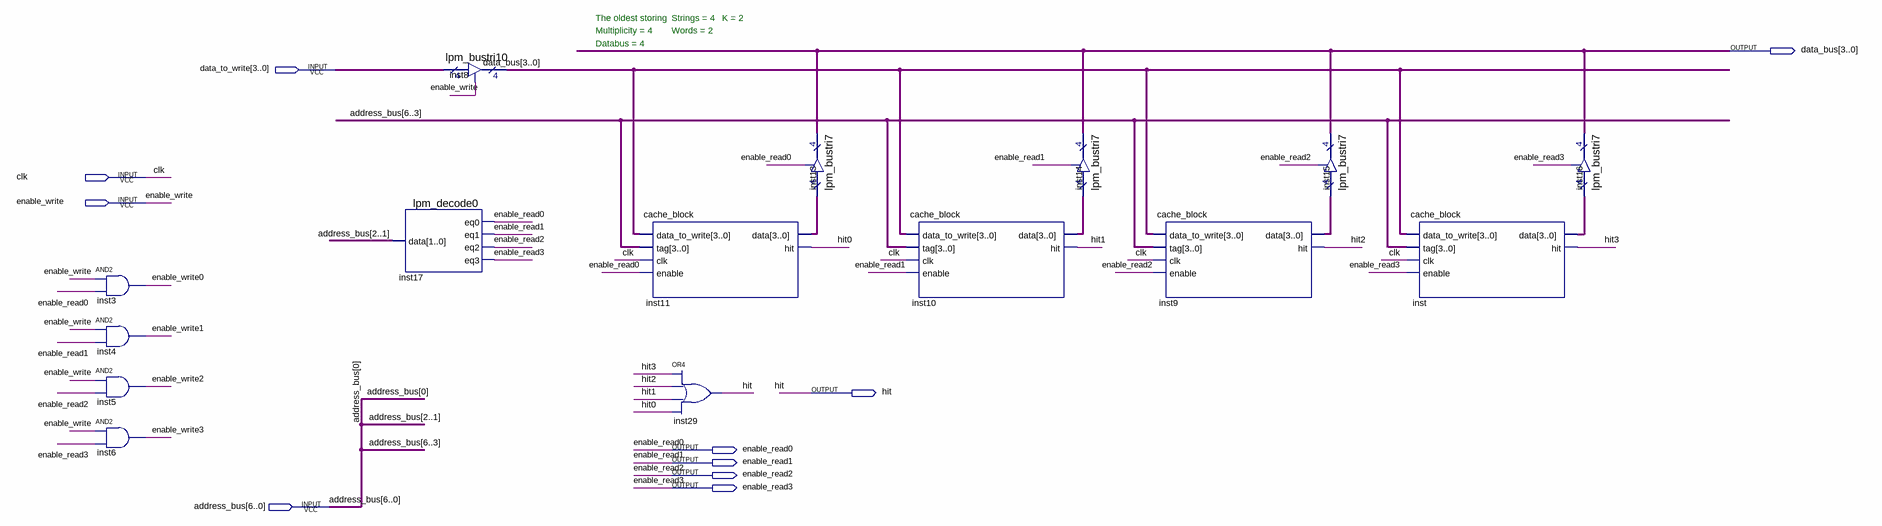
[diagram p0: schematic sheet]
// Quartus schematic cache.bdf as structural Verilog: 15 symbols, 10 pins
module cache (
  input  [3:0] data_to_write,
  input  clk,
  input  enable_write,
  input  [6:0] address_bus,
  output [3:0] data_bus,
  output hit,
  output enable_read0,
  output enable_read1,
  output enable_read2,
  output enable_read3
);

  wire enable_write0, enable_write1, enable_write2, enable_write3, hit0, hit1, hit2, hit3;
  wire [3:0] inst9_data, inst10_data, inst11_data, inst_data;

  and inst3 (enable_write0, enable_write, enable_read0);
  and inst4 (enable_write1, enable_write, enable_read1);
  and inst5 (enable_write2, enable_write, enable_read2);
  and inst6 (enable_write3, enable_write, enable_read3);
  lpm_decode0 inst17 (
    .data(address_bus[2:1]), .eq0(enable_read0), .eq1(enable_read1), .eq2(enable_read2), .eq3(enable_read3));
  lpm_bustri10 inst8 (.enabledt(enable_write), .data(data_to_write), .tridata(data_bus));
  cache_block inst11 (
    .data_to_write(data_bus), .tag(address_bus[6:3]), .clk(clk), .enable(enable_read0), .data(inst11_data),
    .hit(hit0));
  or inst29 (hit, hit3, hit2, hit1, hit0);
  lpm_bustri7 inst13 (.enabledt(enable_read0), .data(inst11_data), .tridata(data_bus));
  cache_block inst10 (
    .data_to_write(data_bus), .tag(address_bus[6:3]), .clk(clk), .enable(enable_read1), .data(inst10_data),
    .hit(hit1));
  lpm_bustri7 inst14 (.enabledt(enable_read1), .data(inst10_data), .tridata(data_bus));
  cache_block inst9 (
    .data_to_write(data_bus), .tag(address_bus[6:3]), .clk(clk), .enable(enable_read2), .data(inst9_data),
    .hit(hit2));
  lpm_bustri7 inst15 (.enabledt(enable_read2), .data(inst9_data), .tridata(data_bus));
  cache_block inst (
    .data_to_write(data_bus), .tag(address_bus[6:3]), .clk(clk), .enable(enable_read3), .data(inst_data),
    .hit(hit3));
  lpm_bustri7 inst16 (.enabledt(enable_read3), .data(inst_data), .tridata(data_bus));

  // Notes on the sheet:
  //   The oldest storing
  //   Strings = 4
  //   K = 2
  //   Multiplicity = 4
  //   Words = 2
  //   Databus = 4
endmodule
